# EAGLE schematic TeensyMain (EAGLE 9.3.2)
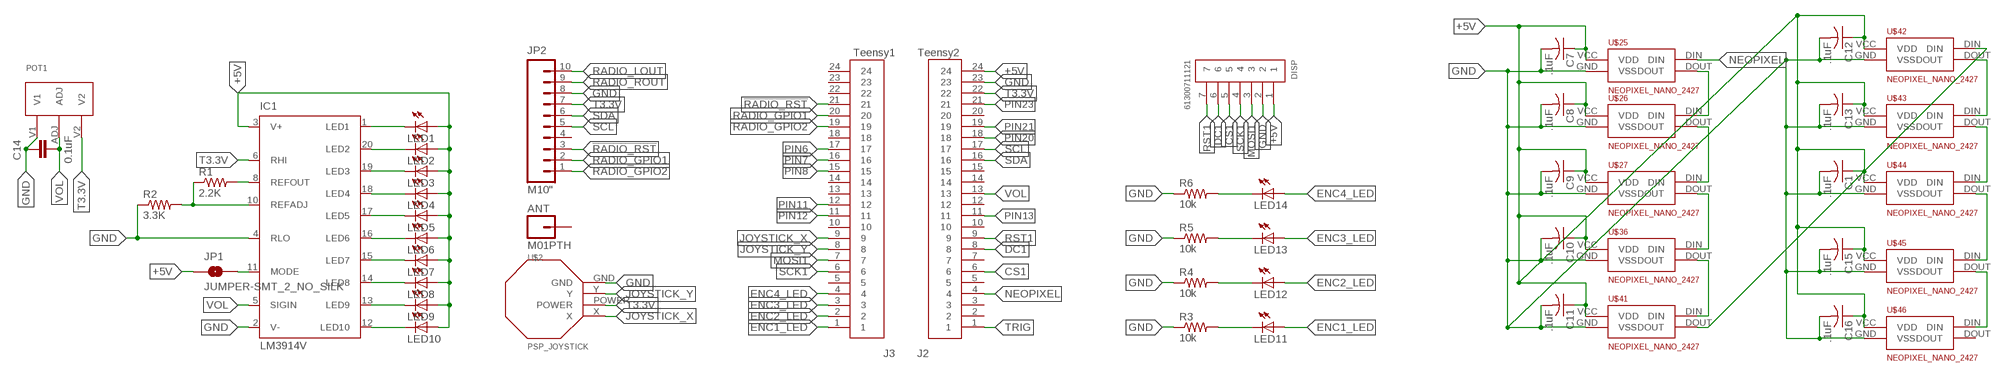
[diagram p0: schematic, sheet 1]

## Parts
ANT  M01PTH  [1X01]
C1  .1uF  C-USC0805  [C0805]
C7  .1uF  C-USC0805  [C0805]
C8  .1uF  C-USC0805  [C0805]
C9  .1uF  C-USC0805  [C0805]
C10  .1uF  C-USC0805  [C0805]
C11  .1uF  C-USC0805  [C0805]
C12  .1uF  C-USC0805  [C0805]
C13  .1uF  C-USC0805  [C0805]
C14  0.1uF  CC0805KRX7R9BB104  [CAP_0805]
C15  .1uF  C-USC0805  [C0805]
C16  .1uF  C-USC0805  [C0805]
DISP  61300711121  [61300711121]
IC1  LM3914V  [PLCC20S]
J2  Teensy2  61302411121  [61302411121]
J3  Teensy1  61302411121  [61302411121]
JP1  JUMPER-SMT_2_NO_SILK  [SMT-JUMPER_2_NO_SILK]
JP2  M10"  [1X10]
LED1  LEDCHIP-LED0805  [CHIP-LED0805]
LED2  LEDCHIP-LED0805  [CHIP-LED0805]
LED3  LEDCHIP-LED0805  [CHIP-LED0805]
LED4  LEDCHIP-LED0805  [CHIP-LED0805]
LED5  LEDCHIP-LED0805  [CHIP-LED0805]
LED6  LEDCHIP-LED0805  [CHIP-LED0805]
LED7  LEDCHIP-LED0805  [CHIP-LED0805]
LED8  LEDCHIP-LED0805  [CHIP-LED0805]
LED9  LEDCHIP-LED0805  [CHIP-LED0805]
LED10  LEDCHIP-LED0805  [CHIP-LED0805]
LED11  LEDCHIPLED_0805  [CHIPLED_0805]
LED12  LEDCHIPLED_0805  [CHIPLED_0805]
LED13  LEDCHIPLED_0805  [CHIPLED_0805]
LED14  LEDCHIPLED_0805  [CHIPLED_0805]
POT1  P0915N_POT  [PO915N_POT]
R1  2.2K  R-US_M0805  [M0805]
R2  3.3K  R-US_M0805  [M0805]
R3  10k  R-US_R0805  [R0805]
R4  10k  R-US_R0805  [R0805]
R5  10k  R-US_R0805  [R0805]
R6  10k  R-US_R0805  [R0805]
U$2  PSP_JOYSTICK  [PSP_JOYSTICK]
U$25  NEOPIXEL_NANO_2427  [SK6805-2427]
U$26  NEOPIXEL_NANO_2427  [SK6805-2427]
U$27  NEOPIXEL_NANO_2427  [SK6805-2427]
U$36  NEOPIXEL_NANO_2427  [SK6805-2427]
U$41  NEOPIXEL_NANO_2427  [SK6805-2427]
U$42  NEOPIXEL_NANO_2427  [SK6805-2427]
U$43  NEOPIXEL_NANO_2427  [SK6805-2427]
U$44  NEOPIXEL_NANO_2427  [SK6805-2427]
U$45  NEOPIXEL_NANO_2427  [SK6805-2427]
U$46  NEOPIXEL_NANO_2427  [SK6805-2427]

## Nets
!RADIO_RST: J3.21 JP2.3
+5V: C1.1 C7.1 C8.1 C9.1 C10.1 C11.1 C12.1 C13.1 C15.1 C16.1 DISP.1 IC1.3(V+) J2.24 JP1.1 LED1.A LED2.A LED3.A LED4.A LED5.A LED6.A LED7.A LED8.A LED9.A LED10.A U$25.VCC(VDD) U$26.VCC(VDD) U$27.VCC(VDD) U$36.VCC(VDD) U$41.VCC(VDD) U$42.VCC(VDD) U$43.VCC(VDD) U$44.VCC(VDD) U$45.VCC(VDD) U$46.VCC(VDD)
CS1: DISP.5 J2.6
DC1: DISP.6 J2.8
ENC1_LED: J3.1 LED11.A
ENC2_LED: J3.2 LED12.A
ENC3_LED: J3.3 LED13.A
ENC4_LED: J3.4 LED14.A
GND: C1.2 C7.2 C8.2 C9.2 C10.2 C11.2 C12.2 C13.2 C14.1 C15.2 C16.2 DISP.2 IC1.2(V-) IC1.4(RLO) J2.23 JP2.8 POT1.V1 R2.1 R3.1 R4.1 R5.1 R6.1 U$2.GND U$25.GND(VSS) U$26.GND(VSS) U$27.GND(VSS) U$36.GND(VSS) U$41.GND(VSS) U$42.GND(VSS) U$43.GND(VSS) U$44.GND(VSS) U$45.GND(VSS) U$46.GND(VSS)
JOYSTICK_X: J3.9 U$2.X
JOYSTICK_Y: J3.8 U$2.Y
MOSI1: DISP.3 J3.7
N$1: IC1.10(REFADJ) R1.1 R2.2
N$2: IC1.1(LED1) LED1.C
N$3: IC1.20(LED2) LED2.C
N$4: IC1.19(LED3) LED3.C
N$5: IC1.18(LED4) LED4.C
N$6: IC1.17(LED5) LED5.C
N$7: IC1.16(LED6) LED6.C
N$8: IC1.15(LED7) LED7.C
N$9: IC1.14(LED8) LED8.C
N$10: IC1.13(LED9) LED9.C
N$11: IC1.12(LED10) LED10.C
N$12: IC1.8(REFOUT) R1.2
N$13: IC1.11(MODE) JP1.2
N$14: LED12.C R4.2
N$15: LED11.C R3.2
N$16: LED14.C R6.2
N$17: LED13.C R5.2
N$18: U$25.DOUT U$26.DIN
N$19: U$26.DOUT U$27.DIN
N$20: U$27.DOUT U$36.DIN
N$21: U$36.DOUT U$41.DIN
N$22: U$41.DOUT U$42.DIN
N$23: U$42.DOUT U$43.DIN
N$24: U$43.DOUT U$44.DIN
N$25: U$44.DOUT U$45.DIN
N$26: U$45.DOUT U$46.DIN
NEOPIXEL: J2.4 U$25.DIN
PIN6: J3.17
PIN7: J3.16
PIN8: J3.15
PIN11: J3.12
PIN12: J3.11
PIN13: J2.11
PIN20: J2.18
PIN21: J2.19
PIN23: J2.21
RADIO_GPIO1: J3.20 JP2.2
RADIO_GPIO2: J3.19 JP2.1
RADIO_LOUT: JP2.10
RADIO_ROUT: JP2.9
RST1: DISP.7 J2.9
SCK1: DISP.4 J3.6
SCL: J2.17 JP2.5
SDA: J2.16 JP2.6
T3.3V: IC1.6(RHI) J2.22 JP2.7 POT1.V2 U$2.POWER
TRIG: J2.1
VOL: C14.2 IC1.5(SIGIN) J2.13 POT1.ADJ
Unconnected: ANT.1 J2.2 J2.3 J2.5 J2.7 J2.10 J2.12 J2.14 J2.15 J2.20 J3.5 J3.10 J3.13 J3.14 J3.18 J3.22 J3.23 J3.24 JP2.4 U$46.DOUT

## Library data of the parts
ANT = SparkFun-Connectors:M01: Header 1 Standard 1-pin 0.1" header. Use with straight break away headers (SKU : PRT-00116), right angle break away headers (PRT-00553), swiss pins (PRT-00743), machine pins (PRT-00117), and female headers (PRT-00115).
C1 C7-C13 C15 C16 = adafruit:C-US: CAPACITOR, American symbol
C14 = Resistor_Capacitor:CC0805KRX7R9BB104: CAP CER 0.1UF 50V X7R 0805 Manufacturer's datasheet <http://www.yageo.com/documents/recent/UPY-GPHC_X7R_6.3V-to-50V_18.pdf>; CREATED_BY: PCBLayout.com; DIGIKEY_PART_NUMBER: 311-1140-2-ND; MANUFACTURER: Yageo; MPN: CC0805KRX7R9BB104; PACKAGE: SMD 0805
DISP = Headers:61300711121: CONN HEADER VERT 7POS 2.54MM Manufacturer's datasheet <https://katalog.we-online.de/em/datasheet/6130xx11121.pdf>; CREATED_BY: PCBLayout.com; DIGI_KEY_PART_NUMBER: 732-5320-ND; MANUFACTURER: Wurth Electronics Inc.; MPN: 61300711121
IC1 = national-semiconductor:LM391: Dot/Bar Display Driver Source: Data sheet LM3915 <http://www.national.com/ds/LM/LM3915.pdf> Data sheet LM3914 <http://www.national.com/ds/LM/LM3914.pdf>
J2 J3 = Headers:61302411121: CONN HEADER VERT 24POS 2.54MM Manufacturer's datasheet <https://katalog.we-online.de/em/datasheet/6130xx11121.pdf>; CREATED_BY: PCBLayout.com; DIGIKEY_PART_NUMBER: 732-5331-ND; MANUFACTURER: Wurth Electronics Inc.; MPN: 61302411121
JP1 = SparkFun-Jumpers:JUMPER-SMT_2_NO: Normally open jumper This jumper has two pads in close proximity to each other. Apply solder to close the connection. Round pads are easier to solder for beginners, but are a lot larger. SparkFun Product that uses the round pads: SparkFun EL Sequencer <https://www.sparkfun.com/products/12781>
JP2 = SparkFun-Connectors:M10: Header 10 Standard 10-pin 0.1" header. Use with straight break away headers (SKU : PRT-00116), right angle break away headers (PRT-00553), swiss pins (PRT-00743), machine pins (PRT-00117), and female headers (PRT-00115).
LED1-LED14 = adafruit:LED: LED OSRAM: - CHIPLED LG R971, LG N971, LY N971, LG Q971, LY Q971, LO R971, LY R971 LH N974, LH R974 LS Q976, LO Q976, LY Q976 LO Q996 - Hyper CHIPLED LW Q18S LB Q993, LB Q99A, LB R99A - SideLED LS A670, LO A670, LY A670, LG A670, LP A670 LB A673, LV A673, LT A673, LW A673 LH A674 LY A675 LS A676, LA A676, LO A676, LY A676, LW A676 LS A679, LY A679, LG A679 - Hyper Micro SIDELED® LS Y876, LA Y876, LO Y876, LY Y876 LT Y87S - SmartLED LW L88C, LW L88S LB L89C, LB L89S, LG L890 LS L89K, LO L89K, LY L89K LS L896, LA L896, LO L896, LY L896 - TOPLED LS T670, LO T670, LY T670, LG T670, LP T670 LSG T670, LSP T670, LSY T670, LOP T670, LYG T670 LG T671, LOG T671, LSG T671 LB T673, LV T673, LT T673, LW T673 LH T674 LS T676, LA T676, LO T676, LY T676, LB T676, LH T676, LSB T676, LW T676 LB T67C, LV T67C, LT T67C, LS T67K, LO T67K, LY T67K, LW E67C LS E67B, LA E67B, LO E67B, LY E67B, LB E67C, LV E67C, LT E67C LW T67C LS T679, LY T679, LG T679 LS T770, LO T770, LY T770, LG T770, LP T770 LB T773, LV T773, LT T773, LW T773 LH T774 LS E675, LA E675, LY E675, LS T675 LS T776, LA T776, LO T776, LY T776, LB T776 LHGB T686 LT T68C, LB T68C - Hyper Mini TOPLED® LB M676 - Mini TOPLED Santana® LG M470 LS M47K, LO M47K, LY M47K Source: http://www.osram.convergy.de/
POT1 = P0915N Potentiometer:P0915N_POT
R1 R2 = adafruit:R-US_: RESISTOR, American symbol
R3-R6 = audio amplifier example:R-US_: RESISTOR, American symbol
U$2 = PSP_Joystick:PSP_JOYSTICK
U$25-U$27 U$36 U$41-U$46 = NeoPixel Nano 2427:NEOPIXEL_NANO_2427